# Altium schematic sheet 3d_printer_housing.SchDoc
size A4; SheetNumber: 1; SheetTotal: 3
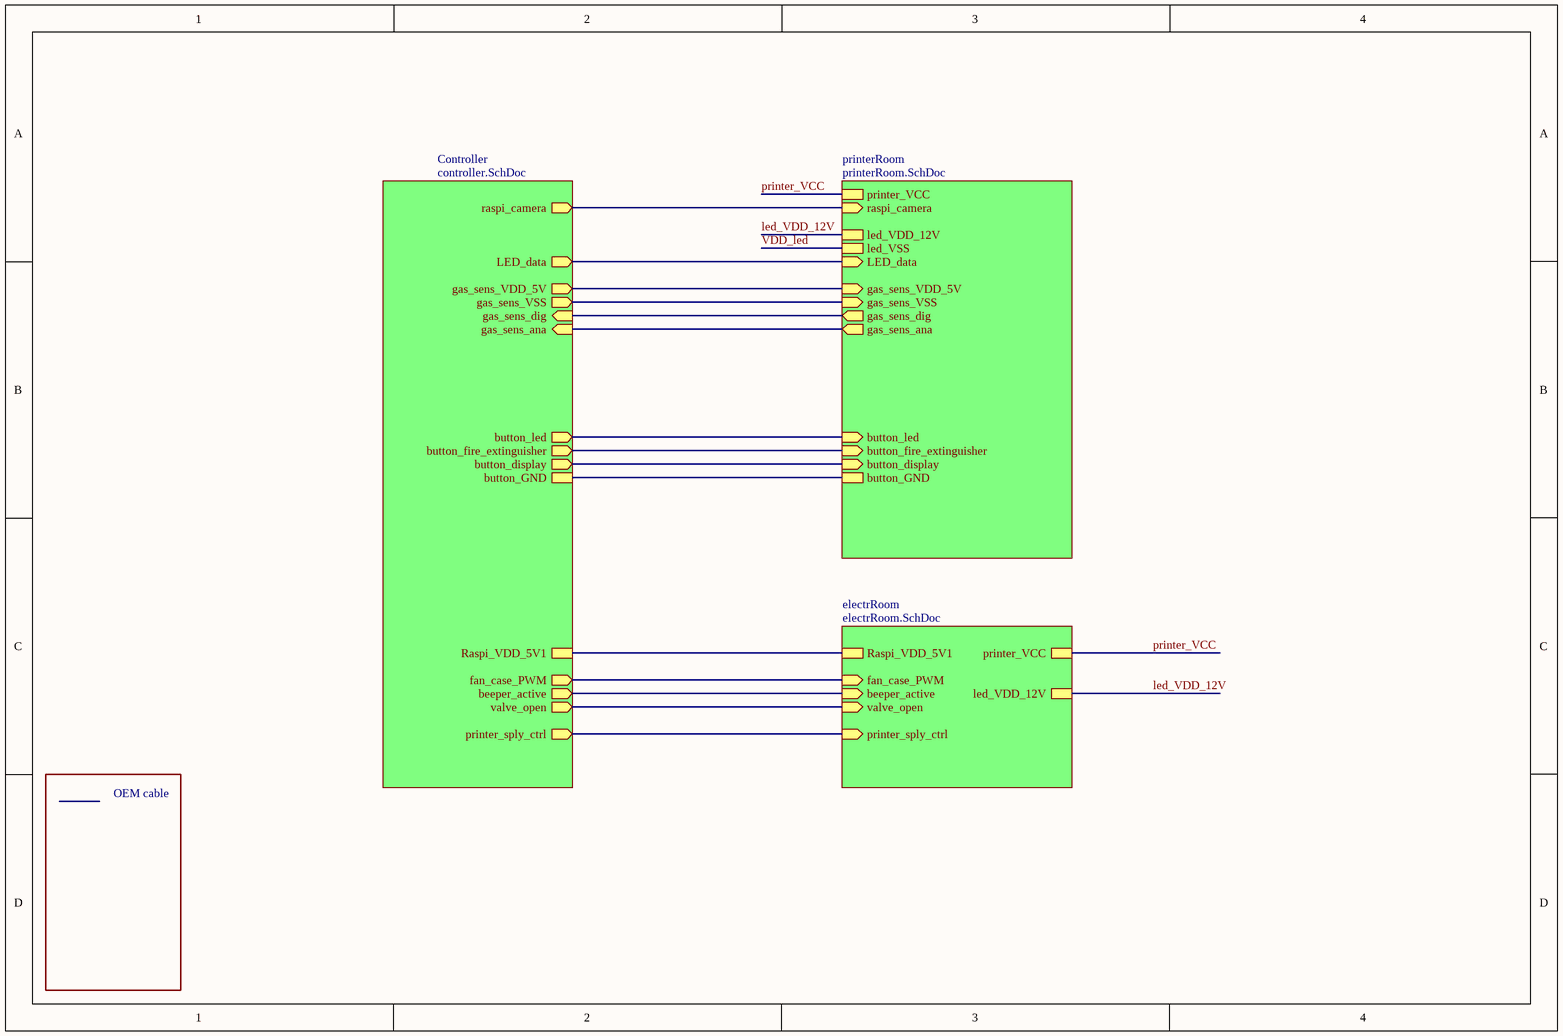
[diagram p0: 3d_printer_housing.SchDoc]

## Sub-sheets
Controller = controller.SchDoc: gas_sens_dig (in), gas_sens_ana (in), button_display (out), button_led (out), LED_data (out), valve_open (out), beeper_active (out), button_fire_extinguisher (out), raspi_camera (out), gas_sens_VDD_5V (out), gas_sens_VSS (out), Raspi_VDD_5V1, button_GND, printer_sply_ctrl (out), fan_case_PWM (out)
electrRoom = electrRoom.SchDoc: printer_VCC, led_VDD_12V, valve_open (in), beeper_active (in), Raspi_VDD_5V1, fan_case_PWM (in), printer_sply_ctrl (in)
printerRoom = printerRoom.SchDoc: button_led (in), button_display (in), gas_sens_dig (out), gas_sens_ana (out), led_VDD_12V, LED_data (in), button_fire_extinguisher (in), button_GND, raspi_camera (in), gas_sens_VDD_5V (in), gas_sens_VSS (in), led_VSS, printer_VCC

## Nets
led_VDD_12V: sheet electrRoom/led_VDD_12V, sheet printerRoom/led_VDD_12V
VDD_led: sheet printerRoom/led_VSS
(unnamed): sheet Controller/gas_sens_dig, sheet printerRoom/gas_sens_dig
(unnamed): sheet Controller/gas_sens_ana, sheet printerRoom/gas_sens_ana
(unnamed): sheet Controller/button_display, sheet printerRoom/button_display
(unnamed): sheet Controller/button_led, sheet printerRoom/button_led
(unnamed): sheet Controller/LED_data, sheet printerRoom/LED_data
(unnamed): sheet Controller/valve_open, sheet electrRoom/valve_open
(unnamed): sheet Controller/beeper_active, sheet electrRoom/beeper_active
(unnamed): sheet Controller/button_fire_extinguisher, sheet printerRoom/button_fire_extinguisher
(unnamed): sheet Controller/gas_sens_VDD_5V, sheet printerRoom/gas_sens_VDD_5V
(unnamed): sheet Controller/gas_sens_VSS, sheet printerRoom/gas_sens_VSS
(unnamed): sheet Controller/button_GND, sheet printerRoom/button_GND
(unnamed): sheet Controller/printer_sply_ctrl, sheet electrRoom/printer_sply_ctrl
(unnamed): sheet Controller/fan_case_PWM, sheet electrRoom/fan_case_PWM

## Buses and harness runs
bus printer_VCC = sheet electrRoom/printer_VCC
bus printer_VCC = sheet printerRoom/printer_VCC
bus sheet Controller/raspi_camera = sheet printerRoom/raspi_camera
bus sheet Controller/Raspi_VDD_5V1 = sheet electrRoom/Raspi_VDD_5V1

## Notes on the sheet
- OEM cable